# Altium project LoadCell.PrjPcb
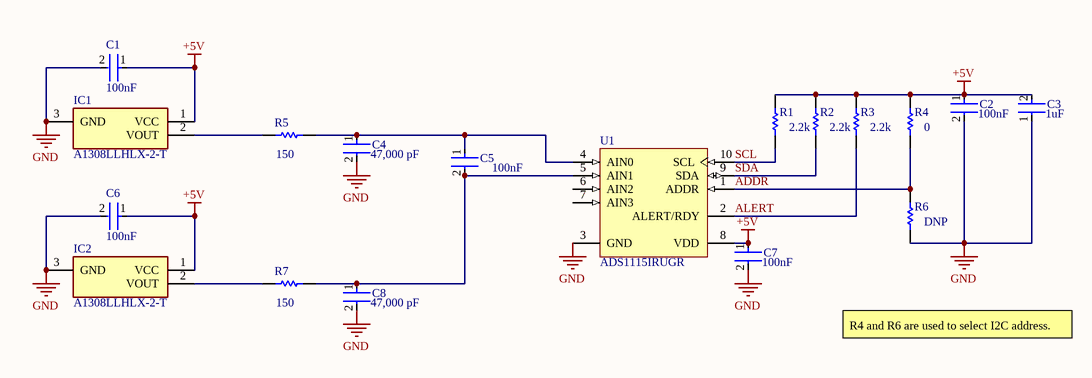
[diagram p0: LoadCell.SchDoc]
1 sheet, 18 parts. Net scope: global (net labels, ports and power ports of the same name join across sheets).
Board file: LoadCell.PcbDoc

## Sheet LoadCell.SchDoc
size A; SheetNumber: 1; SheetTotal: 1

### Parts
C1  Capacitance: 100nF  [FP-CGA3E-0_3-0_1-IPC_A]  (hidden comment: CGA3E2X7R1H104K080AA)
C2  Capacitance: 100nF  [FP-CGA3E-0_3-0_1-IPC_A]  (hidden comment: CGA3E2X7R1H104K080AA)
C3  Capacitance: 1uF  [FP-C1608-080-0_1-IPC_B]  (hidden comment: C1608X5R1H105K080AB)
C4  value 47,000 pF  [FP-C0603C-CF-MFG]  (hidden comment: C0603C473K5RACTU)
C5  Capacitance: 100nF  [FP-CGA3E-0_3-0_1-IPC_A]  (hidden comment: CGA3E2X7R1H104K080AA)
C6  Capacitance: 100nF  [FP-CGA3E-0_3-0_1-IPC_A]  (hidden comment: CGA3E2X7R1H104K080AA)
C7  Capacitance: 100nF  [FP-CGA3E-0_3-0_1-IPC_A]  (hidden comment: CGA3E2X7R1H104K080AA)
C8  value 47,000 pF  [FP-C0603C-CF-MFG]  (hidden comment: C0603C473K5RACTU)
IC1  A1308LLHLX-2-T  [SOT95P285X113-3N]
IC2  A1308LLHLX-2-T  [SOT95P285X113-3N]
R1  value 2.2k  [RESC1609X50X30NL10T20]  (hidden comment: CRCW06032K20FKEA)
R2  value 2.2k  [RESC1609X50X30NL10T20]  (hidden comment: CRCW06032K20FKEA)
R3  value 2.2k  [RESC1609X50X30NL10T20]  (hidden comment: CRCW06032K20FKEA)
R4  Resistance: 0  [RESC1608X55X25ML10T15]  (hidden comment: RC0603JR-070RL)
R5  value 150  [RESC1608X55X25ML10T15]  (hidden comment: RC0603FR-07150RL)
R6  Resistance: DNP  [RESC1608X55X25ML10T15]  (hidden comment: RC0603JR-070RL)
R7  value 150  [RESC1608X55X25ML10T15]  (hidden comment: RC0603FR-07150RL)
U1  ADS1115IRUGR  [TI-RUG10_V]

### Nets
+5V: C1.1 C2.1 C3.2 C6.1 C7.1 IC1.1(VCC) IC2.1(VCC) R1.2 R2.2 R3.2 R4.2 U1.8(VDD)
GND: C1.2 C2.2 C3.1 C4.2 C6.2 C7.2 C8.2 IC1.3(GND) IC2.3(GND) R6.1 U1.3(GND)
ADDR: R4.1 R6.2 U1.1(ADDR)
ALERT: R3.1 U1.2(ALERT/RDY)
SCL: R1.1 U1.10(SCL)
SDA: R2.1 U1.9(SDA)
NetC4_1: C4.1 C5.1 R5.2 U1.4(AIN0)
NetC5_2: C5.2 C8.1 R7.2 U1.5(AIN1)
NetIC1_2: IC1.2(VOUT) R5.1
NetIC2_2: IC2.2(VOUT) R7.1

Not connected (* = marked no-connect by the designer): U1 6(AIN2) 7(AIN3)

### Notes on the sheet
- R4 and R6 are used to select I2C address.

### Library data of the parts
C1 C2 C5-C7 = CMP-2000-07546-2: Cap Ceramic 100nF 50V X7R 10% Pad SMD 0603 +125°C Automotive T/R; Weight: 7.1E-05oz; Composition: Ceramic; Max Operating Temperature: 125°C; Termination: SMD/SMT; Dielectric: X7R; Length: 1.6mm; Package Quantity: 1; REACH SVHC: No SVHC; Lead Free: Lead Free; Case Code (Metric): 1608; Min Operating Temperature: -55°C; Packaging: Tape and Reel; Tolerance: 10%; Voltage Rating: 50V; Case Code (Imperial): 0603; Case/Package: 0603; Voltage Rating (DC): 50V; Depth: 0.8mm; Radiation Hardening: No; Ratings: AEC-Q200; Mount: Surface Mount; Voltage: 50V; Thickness: 0.035inch; Width: 0.8mm; Height: 0.8mm
C3 = CMP-2000-06025-2: Multilayer Ceramic Capacitors 1μF ±10% 50V X5R SMD 0603; Lead Free: Lead Free; Height: 0.8mm; Mount: Surface Mount; Radiation Hardening: No; Thickness: 0.035inch; Length: 1.6mm; Max Operating Temperature: 85°C; REACH SVHC: No SVHC; Min Operating Temperature: -55°C; Construction: Flat; RoHS Compliant: Yes; Voltage Rating: 50V; Dielectric: X5R; Packaging: Tape and Reel; Termination: SMD/SMT; Voltage Rating (DC): 50V; Case Code (Imperial): 0603; Voltage: 50V; Width: 0.031inch; Weight: 7.1E-05oz; Depth: 0.8mm; Case Code (Metric): 1608; Series: C; Case/Package: 0603; Tolerance: 10%; Resistor Type: Ceramic; Number of Pins: 2; Dielectric Material: Ceramic; Package Quantity: 1
C4 C8 = CMP-2006-03232-2: CAP CER 0.047UF 50V 10% X7R 0603; Manufacturer: KEMET; Tolerance: 0.1; Temperature Coefficient: 30ppm/°C; Material: Ceramic; Automotive Grade: Grade 1; Lead Free: Yes; ComponentLink2URL: https://api.kemet.com/component-edge/download/datasheet/C0603C100J5GACAUTO.pdf; Temperature Characteristic: X7R; Category: Cap; Temperature Range High: +125°C; Automotive: Yes; Device Class L3: Ceramic Capacitors; Height: 0.87mm; Temperature: -55°C to +125°C; Mouser Description: Multilayer Ceramic Capacitors MLCC - SMD/SMT 50volts 47000pF X7R 10%; Package: C0603C-CF; Device Class L1: Passive Components; Digikey Description: CAP CER 0.047UF 50V 10% X7R 0603; Device Class L2: Capacitors; Voltage Rating: 50 V; Capacitance: 47,000 pF; ComponentLink2Description: Datasheet; RoHS: TRUE; Manufacturer Part Number: C0603C473K5RACTU; Octopart: https://octopart.com/c0603c473k5ractu-kemet-9138594; Temperature Range Low: -55°C
IC1 IC2 = A1308LLHLX-2-T: Integrated Circuit; Manufacturer_Name: Allegro Microsystems; Datasheet Link: http://www.allegromicro.com/~/media/files/datasheets/a1308-9-datasheet.pdf; Height: 1.13mm; Manufacturer_Part_Number: A1308LLHLX-2-T; Mouser Part Number: 250-A1308LLHLX-2-T; Mouser Price/Stock: https://www.mouser.co.uk/ProductDetail/Allegro-MicroSystems/A1308LLHLX-2-T?qs=pUKx8fyJudC4S4ikpanetA%3D%3D; Arrow Part Number: A1308LLHLX-2-T; Arrow Price/Stock: https://www.arrow.com/en/products/a1308llhlx-2-t/allegro-microsystems?region=nac
R1-R3 = CMP-2000-03167-1: Manufacturer: Vishay Dale; Part Number: CRCW06032K20FKEA
R4 R6 = CMP-2100-03667-1: Chip Resistor, 0 Ohm, +/- 5%, 0.1 W, -55 to 155 degC, 0603 (1608 Metric), RoHS, Tape and Reel; Manufacturer: Yageo; Temperature Coefficient: 200ppm/degreesC; Voltage Rating: 50V; Power Rating: 100mW; Width: 0.8mm; Max Operating Temperature: 155degC; Tolerance: 5%; Package Reference: 0603; Height: 0.45mm; Depth: 0.8mm; Package Description: 2-Pin Surface Mount Device, Body 1.6 x 0.8 mm; Termination: SMD/SMT; Package Quantity: 5000; Case/Package: 0603; Case Code (Imperial): 0603; Radiation Hardening: No; Number of Pins: 2; Length: 1.6mm; Lead Free: LeadFree; Voltage Rating (DC): 50V; Military Standard: Not; Datasheet URL: http://www.yageo.com/NewPortal/yageodocoutput?fileName=/pdf/R-Chip/PYu-RC_Group_51_RoHS_L_5.pdf; Manufacturer URL: http://www.yageo.com/; Packaging: TapeandReel; Case Code (Metric): 1608; Min Operating Temperature: -55degC; Composition: ThickFilm; RoHSCompliant: true; Contact Plating: Tin; Datasheet Version: Rev. 5, 10/2016; REACH SVHC: NoSVHC
R5 R7 = CMP-1659-00057-1: Chip Resistor, 150 Ohm, +/- 1%, 0.1 W, -55 to 155 degC, 0603 (1608 Metric), RoHS, Tape and Reel; Viewing Angle: 20 degrees; Luminous Intensity: 200 mcd; Case\Package: Radial; Lens Style: Clear; Nominal Vf: 2.2 V; Illumination Colour: Green; PackageReference: 0603; PackageDescription: 2-Pin Surface Mount Device, Body 1.6 x 0.8 mm; Package Quantity: 1000; Packaging: Bulk; DatasheetVersion: Rev. 4, 02/2016; ComponentLink2URL: http://www.yageo.com/documents/recent/PYu-RC_Group_51_RoHS_L_04.pdf; ComponentLink1Description: Manufacturer URL; Height: 8.6 mm; ComponentLink2Description: Datasheet; Mount: Through Hole; Colour: Green; RoHSCompliant: true; ComponentLink1URL: http://www.yageo.com/; Forward Voltage: 2.2 V
U1 = CMP-0003-00970-1: 16-Bit ADC with Integrated Multiplexer, PGA, Comparator, Oscillator, and Reference, -40 to 125 degC, 10-pin HandDrawn (RUG10), Green (RoHS & no Sb/Br); Manufacturer: Texas Instruments; Analog Voltage AV/DD(Max)(V): 5.5; Analog Voltage AV/DD(Min)(V): 2; Sample Rate (max)(SPS): 860; Resolution(Bits): 16; Architecture: Delta-Sigma; INL(Max)(+/-LSB): 1; Interface: Serial I2C; # Input Channels: 4; SubFamily: Precision ADC (<=10MSPS); ComponentLink3URL: http://www.ti.com/litv/pdf/mpqf216a; Digital Supply(Min)(V): 2; Digital Supply(Max)(V): 5.5; PackageReference: RUG10; Eco-Plan: Green (RoHS & no Sb/Br); DatasheetVersion: SBAS444B; ComponentLink2Description: Datasheet; ComponentLink2URL: http://www.ti.com/general/docs/lit/getliterature.tsp?genericPartNumber=ADS1115&fileType=pdf; PackageVersion: 4208528-3/B, 04/2008; ComponentLink3Description: Package Specification; ComponentLink1Description: Manufacturer URL; PartNumber: ADS1115IRUGR; ComponentLink1URL: http://www.ti.com/; PackageDescription: 10-Pin Plastic Quad Flatpack, Body 1.5 x 2 mm, Pitch 0.5 mm; Mounting Technology: Surface Mount; Code_JEDEC: MO-288